# EasyEDA Pro project 第十届农装PCB工程.epro, schematic Schematic1_1
Board Name: F103作业板; Create Date: 2024-08-23; Page Name: P1; Project Name: 智能农装; Schematic Name: Schematic1_1; Update Date: 2024-09-09
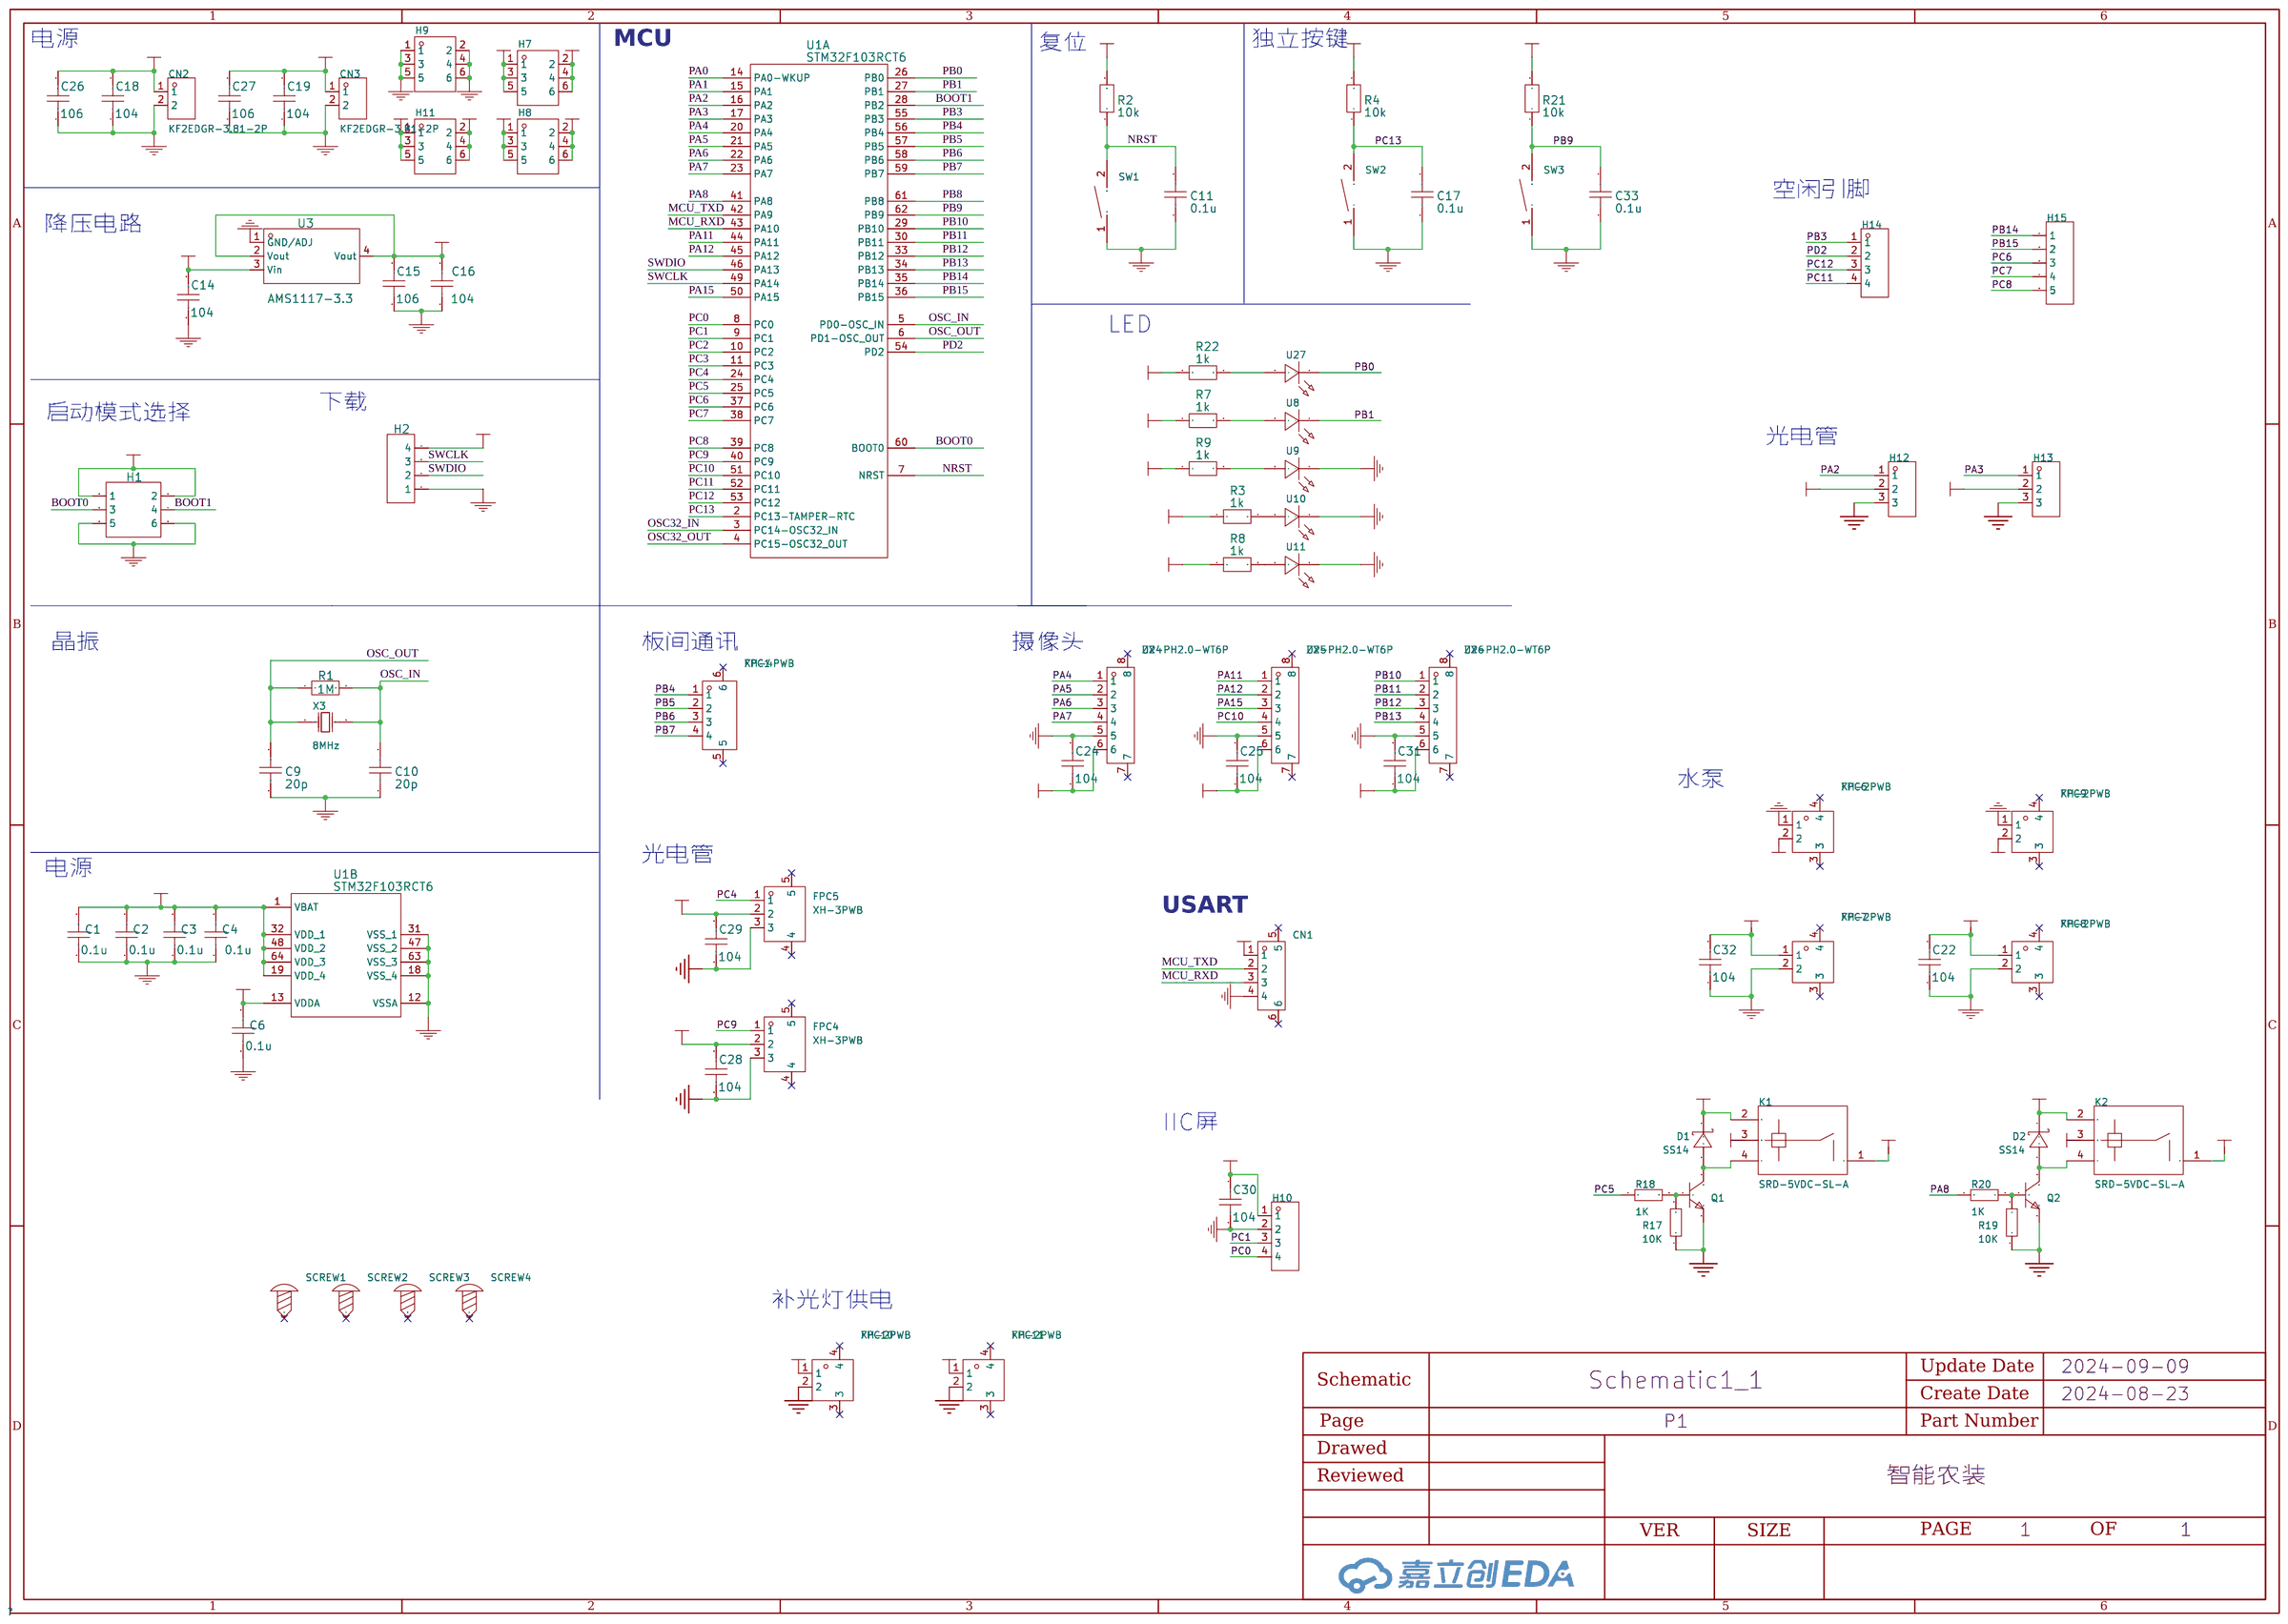
[diagram p1: schematic sheet]

## Parts
C1  0.1u  [C0805]
C2  0.1u  [C0805]
C3  0.1u  [C0805]
C4  0.1u  [C0805]
C6  0.1u  [C0805]
C9  20p  [C0805]
C10  20p  [C0805]
C11  0.1u  [C0805]
C14  104  [C0805]
C15  106  [C0805]
C16  104  [C0805]
C17  0.1u  [C0805]
C18  104  [C0805]
C19  104  [C0805]
C22  104  [C0805]
C24  104  [C0805]
C25  104  [C0805]
C26  106  [C0805]
C27  106  [C0805]
C28  104  [C0805]
C29  104  [C0805]
C30  104  [C0805]
C31  104  [C0805]
C32  104  [C0805]
C33  0.1u  [C0805]
CN1  -  [CONN-SMD_2.54-4P-WT-1]
CN2  KF2EDGR-3.81-2P  [CONN-TH_2P-P3.81_KF2EDGR-3.81-2P]
CN3  KF2EDGR-3.81-2P  [CONN-TH_2P-P3.81_KF2EDGR-3.81-2P]
D1  SS14  [SMA_L4.2-W2.6-LS5.3-RD]
D2  SS14  [SMA_L4.2-W2.6-LS5.3-RD]
FPC1  XH-4PWB  [CONN-SMD_4P-P2.50_DEALON_XH-4PWB]
FPC4  XH-3PWB  [CONN-SMD_3P-P2.50_DEALON_XH-3PWB]
FPC5  XH-3PWB  [CONN-SMD_3P-P2.50_DEALON_XH-3PWB]
FPC6  XH-2PWB  [CONN-SMD_2P-P2.50_DEALON_XH-2PWB_C2905024]
FPC7  XH-2PWB  [CONN-SMD_2P-P2.50_DEALON_XH-2PWB_C2905024]
FPC8  XH-2PWB  [CONN-SMD_2P-P2.50_DEALON_XH-2PWB_C2905024]
FPC9  XH-2PWB  [CONN-SMD_2P-P2.50_DEALON_XH-2PWB_C2905024]
FPC10  XH-2PWB  [CONN-SMD_2P-P2.50_DEALON_XH-2PWB_C2905024]
FPC11  XH-2PWB  [CONN-SMD_2P-P2.50_DEALON_XH-2PWB_C2905024]
H1  HDR-F-2.54_2x3  [HDR-F-2.54_2X3]
H2  2.54-1*4P母  [HDR-TH_4P-P2.54-V-F]
H7  -  [HDR-TH_6P-P2.54-V-R2-C3-S2.54_A2541WV-2X3P]
H8  -  [HDR-TH_6P-P2.54-V-R2-C3-S2.54_A2541WV-2X3P]
H9  -  [HDR-TH_6P-P2.54-V-R2-C3-S2.54_A2541WV-2X3P]
H10  -  [HDR-TH_4P-P2.54-V-M]
H11  -  [HDR-TH_6P-P2.54-V-R2-C3-S2.54_A2541WV-2X3P]
H12  -  [HDR-TH_3P-P2.54-V-F]
H13  -  [HDR-TH_3P-P2.54-V-F]
H14  -  [HDR-TH_4P-P2.54-V-F]
H15  -  [HDR-TH_5P-P2.54-V-F]
K1  SRD-5VDC-SL-A  [RELAY-TH_SRD-XXVDC-XX-A]
K2  SRD-5VDC-SL-A  [RELAY-TH_SRD-XXVDC-XX-A]
Q1  -  [S8050_SOT-23]
Q2  -  [S8050_SOT-23]
R1  1M  [R0805_NEW]
R2  10k  [R0805_NEW]
R3  1k  [R0805_NEW]
R4  10k  [R0805_NEW]
R7  1k  [R0805_NEW]
R8  1k  [R0805_NEW]
R9  1k  [R0805_NEW]
R17  10K  [R0805]
R18  1K  [R0805]
R19  10K  [R0805]
R20  1K  [R0805]
R21  10k  [R0805_NEW]
R22  1k  [R0805_NEW]
SCREW1  -  [M3螺丝]
SCREW2  -  [M3螺丝]
SCREW3  -  [M3螺丝]
SCREW4  -  [M3螺丝]
SW1  -  [SW-SMD_L6.1-W3.6-LS8.0]
SW2  -  [SW-SMD_L6.1-W3.6-LS8.0]
SW3  -  [SW-SMD_L6.1-W3.6-LS8.0]
U1  STM32F103RCT6  [STM32F103RCT6]  (sections 1,2)
U3  AMS1117-3.3  [AMS1117]
U8  -  [LED0805-RD_PURPLE]
U9  -  [LED0805-RD_PURPLE]
U10  -  [LED0805-RD_PURPLE]
U11  -  [LED0805-RD_PURPLE]
U24  ZX-PH2.0-WT6P  [CONN-SMD_6P-P2.00_ZX-PH2.0-WT6P]
U25  ZX-PH2.0-WT6P  [CONN-SMD_6P-P2.00_ZX-PH2.0-WT6P]
U26  ZX-PH2.0-WT6P  [CONN-SMD_6P-P2.00_ZX-PH2.0-WT6P]
U27  -  [LED0805-RD_PURPLE]
X3  8MHz  [OSC-SMD_L5.0-W3.2]

## Library data of the parts
C1-C4 C6 C11 C17 C33 = 0.1u
C9 C10 = 20p
C14 C16 C18 C19 C22 C24 C25 C28-C32 = 4.7u
C15 C26 C27 = 1u
CN1 = 2.54-4P-WT: 参考系列:XH;间距:2.5mm;插针结构:1x4P;排数:1;每排PIN数:4;行距:-;公母:公型插针;安装方式:卧贴;额定电流:500mA;工作温度范围:-25~+85;; Supplier Part: C722701; Manufacturer: CAX(创都); Supplier Footprint: SMD,P=2.5mm; JLCPCB Part Class: ExtendedPart; Datasheet: https://atta.szlcsc.com/upload/public/pdf/source/20200831/C722696_77A3476FAF7CFEE79ECA533977340414.pdf; Supplier: LCSC; Reference Series: XH; Pitch: 2.5mm; Pins Structure: 1x4P; Number of Rows: 1; Number of PINs Per Row: 4; Gender: 公型插针; Mounting Style: 卧贴; Current Rating (Max): 500mA; Operating Temperature Range: -25~+85
CN2 CN3 = KF2EDGR-3.81-2P: 连接器类型:板端/插座-闭口;结构:1x2P;间距:3.81mm;颜色:绿色;安装方式:弯针;排数:1;每排PIN数:2;额定电流:8A;额定电压:300V;工作温度范围:-40℃~+105℃;; LCSC Part Name: 3.81mm 1x2P 排数:1 每排P数:2; Supplier Part: C441182; Manufacturer: KEFA(科发); Supplier Footprint: 弯插,P=3.81mm; JLCPCB Part Class: Extended Part; Datasheet: https://atta.szlcsc.com/upload/public/pdf/source/20230331/6258E6C6BF04EFF922F3E5A9E72A4547.pdf; Supplier: LCSC; Connector Type: 板端/插座-闭口; Structure: 1x2P; Pitch: 3.81mm; Color: 绿色; Mounting Style: 弯针; Number of Pins: 2P; Number of Rows: 1; Number of PINs Per Row: 2; Current Rating (Max): 8A; Voltage Rating (Max): 300V; Operating Temperature Range: -40℃~+105℃
D1 D2 = SS14_C2480: 二极管配置:独立式;正向压降(Vf):550mV@1A;直流反向耐压(Vr):40V;平均整流电流(Io):1A;; LCSC Part Name: 电压:40V 电流:1A; Supplier Part: C2480; Manufacturer: MDD; Supplier Footprint: SMA(DO-214AC); JLCPCB Part Class: Basic Part; Datasheet: https://atta.szlcsc.com/upload/public/pdf/source/20230712/2DB6064CFBB99DE6DB116BEE8208BE66.pdf; Supplier: LCSC; Diode Configuration: 独立式; Forward Voltage (Vf@If): 550mV@1A; Reverse Voltage (Vr): 40V; Average Rectified Current (Io): 1A; Reverse Leakage Current (Ir): 500uA@40V
FPC1 = XH-4PWB: 插针结构:1x4P;间距:2.5mm;安装方式:卧贴;参考系列:XH;总PIN数:4P;排数:1;每排PIN数:4;行距:-;额定电流:3A;工作温度范围:-25℃~+85℃;; LCSC Part Name: 1x4P 间距:2.5mm 卧贴 系列:XH; Supplier Part: C2905026; Manufacturer: DEALON(德艺隆); Supplier Footprint: SMD,P=2.5mm,卧贴; JLCPCB Part Class: Extended Part; Datasheet: https://atta.szlcsc.com/upload/public/pdf/source/20211025/6C2B75DB1AEBD099C7E95723735B67A6.pdf; Supplier: LCSC; Pins Structure: 1x4P; Pitch: 2.5mm; Mounting Style: 卧贴; Reference Series: XH; Number of Pins: 4P; Number of Rows: 1; Number of PINs Per Row: 4; Current Rating (Max): 3A; Operating Temperature Range: -25℃~+85℃
FPC4 FPC5 = XH-3PWB: 插针结构:1x3P;间距:2.5mm;安装方式:卧贴;参考系列:XH;总PIN数:3P;排数:1;每排PIN数:3;行距:-;额定电流:3A;工作温度范围:-25℃~+85℃;; LCSC Part Name: 1x3P 间距:2.5mm 卧贴 系列:XH; Supplier Part: C2905025; Manufacturer: DEALON(德艺隆); Supplier Footprint: SMD,P=2.5mm,卧贴; JLCPCB Part Class: Extended Part; Datasheet: https://atta.szlcsc.com/upload/public/pdf/source/20211025/6C2B75DB1AEBD099C7E95723735B67A6.pdf; Supplier: LCSC; Pins Structure: 1x3P; Pitch: 2.5mm; Mounting Style: 卧贴; Reference Series: XH; Number of Pins: 3P; Number of Rows: 1; Number of PINs Per Row: 3; Current Rating (Max): 3A; Operating Temperature Range: -25℃~+85℃
FPC6-FPC11 = XH-2PWB: 插针结构:1x2P;间距:2.5mm;安装方式:卧贴;参考系列:XH;总PIN数:2P;排数:1;每排PIN数:2;行距:-;额定电流:3A;工作温度范围:-25℃~+85℃;; LCSC Part Name: 1x2P 间距:2.5mm 卧贴 系列:XH; Supplier Part: C2905024; Manufacturer: DEALON(德艺隆); Supplier Footprint: SMD,P=2.5mm,卧贴; JLCPCB Part Class: Extended Part; Datasheet: https://atta.szlcsc.com/upload/public/pdf/source/20211025/6C2B75DB1AEBD099C7E95723735B67A6.pdf; Supplier: LCSC; Pins Structure: 1x2P; Pitch: 2.5mm; Mounting Style: 卧贴; Reference Series: XH; Number of Pins: 2P; Number of Rows: 1; Number of PINs Per Row: 2; Current Rating (Max): 3A; Operating Temperature Range: -25℃~+85℃
H1 = HDR-F-2.54_2x3: Supplier Part: C65114; Supplier: LCSC
H2 = 2.54-1*4P母: 间距:2.54mm;总孔位数:4;排数:1;插孔结构:1x4P;行距:-;安装类型:直插;圆孔/方孔:方孔;额定电流:3A;额定电压:-;插孔方向:顶部;塑高:-;触头材质:青铜;触头镀层:-;工作温度范围:-40℃~+105℃;焊接温度(最大值):-;; LCSC Part Name: 2.54mm 1x4P; Supplier Part: C2718488; Manufacturer: BOOMELE(博穆精密); Supplier Footprint: 直插,P=2.54mm; JLCPCB Part Class: Extended Part; Datasheet: https://atta.szlcsc.com/upload/public/pdf/source/20210301/C2718488_F4427B881E42CAA8DDB0B1C12B3A522C.pdf; Supplier: LCSC; Pitch: 2.54mm; Number of Holes: 4; Number of Rows: 1; Holes Structure: 1x4P; Mounting Type: 直插; Circular Hole / Square Hole: 方孔; Current Rating (Max): 3A; Holes Direction: 顶部; Contact Material: 青铜; Operating Temperature Range: -40℃~+105℃
H7-H9 H11 = 210-72-03GB01: 间距:2.54mm;总PIN位数:6;排数:2;插针结构:2x3P;行距:2.54mm;安装类型:直插;圆针/方针:方针;额定电流:-;额定电压:-;配合针长度:6.1mm;塑高:2.5mm;端接针长度:3mm;触头材质:黄铜;触头镀层:-;工作温度范围:-40~+105;颜色:黑色;; LCSC Part Name: 2.54mm2x3P直插方针; Supplier Part: C402781; Manufacturer: PINREX(频锐科技); Supplier Footprint: 直插,P=2.54mm; JLCPCB Part Class: ExtendedPart; Datasheet: https://atta.szlcsc.com/upload/public/pdf/source/20190710/C402781_43A1999CD2F74066250BE88CD0917A4C.pdf; Supplier: LCSC; Pitch: 2.54mm; Number of Pins: 6; Number of Rows: 2; Pin Structure: 2x3P; Row Spacing: 2.54mm; Mounting Type: 直插; Circluar Pins/Square Pins: 方针; Length of Mating Pin: 6.1mm; Insulation Height: 2.5mm; Length of End Connection Pin: 3mm; Contact Material: 黄铜; Operating Temperature Range: -40~+105; Color: 黑色
H10 = HDR-M_2.54_1x4P: Supplier Part: C492403; Supplier Footprint: 插件
H12 H13 = HDR-F_2.54_1x3P: Supplier Part: C541850; Supplier Footprint: 插件
H14 = HDR-F_2.54_1x4P: Supplier Part: C2718488; Supplier Footprint: 插件
H15 = HDR-F_2.54_1x5P: Supplier Part: C50950; Supplier Footprint: 插件
K1 K2 = SRD-5VDC-SL-A: 线圈电压:5V;触点形式:一组常开:1A(单刀单掷-常开);触点容量(电阻负载):-;最大切换电压:250V@AC;最大切换电流:15A;; LCSC Part Name: 蓝色; Supplier Part: C140615; Manufacturer: 松乐; Supplier Footprint: 插件,15.6x19.2mm; JLCPCB Part Class: 扩展库; Datasheet: https://atta.szlcsc.com/upload/public/pdf/source/20200305/C490149_C96E4098A3B1FFB377D5AD2E40B7C2A8.pdf; Supplier: LCSC; Coil Voltage: 5V; Contact Form: 一组常开:1A(单刀单掷-常开); Pin Number: 4; Maximum Switching Voltage: 250V@AC; Coil Rated Power: 360mW; Maximum Switching Current: 15A; Coil Type: 无极性-单线圈; Coil Resistance: 70Ω; Contact Resistance: 100mΩ; Operate Time: 10ms; Release Time: 10ms
Q1 Q2 = S8050_SOT_NPN: Supplier Footprint: SOT-23
R1 = 1M
R2 R4 R21 = 10k
R3 R7-R9 R22 = 1k
R17-R20 = Res_0805: Supplier Footprint: 0805
SCREW1-SCREW4 = M3螺丝: Supplier Footprint: 插件
SW1-SW3 = TSA363G25-250B: 触点电流:50mA;额定电压(DC):12V;绝缘电阻:100MΩ;电路结构:单刀单掷;安装方式:立贴;按钮形状:矩形按钮;按钮/盖帽颜色:白色;带灯:无;作用力:250gf@±50gf;机械寿命:50000;工作温度:-25~+70;引脚样式:鸥翼型;开关长度:6.05mm;开关宽度:3.6mm;开关高度:2.5mm;带支架:否;; LCSC Part Name: 3*6*2.5白柄贴片250gf; Supplier Part: C354943; Manufacturer: BRIGHT(博瑞泰); Supplier Footprint: SMD; JLCPCB Part Class: ExtendedPart; Datasheet: https://atta.szlcsc.com/upload/public/pdf/source/20190426/C354943_F8D02988919B0D3B4D493E3C3D798834.pdf; Supplier: LCSC; Contact Current: 50mA; Voltage Rating (DC): 12V; Insulation Resistance: 100MΩ; Circuit: 单刀单掷; Mounting Style: 立贴; Actuator Style: 矩形按钮; Actuator/Cap Color: 白色; With Lamp: 无; Operating Force: 250gf@±50gf; Mechanical Life: 50000; Operating Temperature: -25~+70; Pin Style: 鸥翼型; Switch Length: 6.05mm; Switch Width: 3.6mm; Switch Height: 2.5mm; Strike Gundam: 否
U1 = STM32F103RCT6: Supplier: LCSC; Manufacturer: STMicroelectronics; image: //image.lceda.cn/szlcsc/C8323.jpg; Supplier Part: C8323; JLCPCB Part Class: Basic
U3 = AMS1117-3.3: Supplier: LCSC; Manufacturer: AMS; Supplier Part: C6186; JLCPCB Part Class: BasicPart
U8-U11 U27 = P2-0805UVTCS2-0.8T: 峰值波长:410nm~420nm;发光角度:120°;正向电压:3V;正向电流:30mA;功耗:90mW;工作温度:-40~+85;抗静电能力:2kV;辐射功率:-;; LCSC Part Name: 0805紫光0.8T; Supplier Part: C2827270; Manufacturer: TUOZHAN(拓展光电); Supplier Footprint: 0805; JLCPCB Part Class: ExtendedPart; Datasheet: https://atta.szlcsc.com/upload/public/pdf/source/20210423/C2827270_475A43B7F06EF651B4600F80B81B4A43.pdf; Supplier: LCSC; Peak Wavelength: 410nm~420nm; Viewing Angle: 120°; Forward Voltage: 3V; Forward Current: 30mA; Power Dissipation: 90mW; Operating Temperature: -40~+85; Antistatic Ability: 2kV
U24-U26 = ZX-PH2.0-WT6P: 插针结构:1x6P;间距:2mm;安装方式:卧贴;参考系列:PH;总PIN数:6P;排数:1;每排PIN数:6;行距:-;额定电流:2A;触头材质:黄铜;触头镀层:锡;工作温度范围:-25℃~+85℃;; Supplier Part: C7429693; Manufacturer: Megastar(兆星); Supplier Footprint: SMD,P=2mm,卧贴; JLCPCB Part Class: 扩展库; Datasheet: https://atta.szlcsc.com/upload/public/pdf/source/20230619/91235C4686D19130EBBA01431FCA1390.pdf; Supplier: LCSC; Pins Structure: 1x6P; Pitch: 2mm; Mounting Style: 卧贴; Reference Series: PH; Number of Pins: 6P; Number of Rows: 1; Number of PINs Per Row: 6; Current Rating (Max): 2A; Contact Material: 黄铜; Contact Plating: 锡; Operating Temperature Range: -25℃~+85℃
X3 = 7A08000006: 晶振类型:贴片无源晶振;频率:8MHz;频率公差:±20ppm;负载电容:12pF;等效串联电阻(ESR):80Ω;工作温度:-10~+70;; LCSC Part Name: 8MHz±20ppm12pF; Supplier Part: C128364; Manufacturer: TXC(晶技); Supplier Footprint: SMD5032-2P; JLCPCB Part Class: ExtendedPart; Datasheet: https://atta.szlcsc.com/upload/public/pdf/source/20170914/C128364_1505359754186967908.pdf; Supplier: LCSC; Crystal Type: 贴片无源晶振; Frequency Tolerance: ±20ppm; Load Capacitance: 12pF; Equivalent Series Resistance (ESR): 80Ω; Operating Temperature: -10~+70

## Nets
3.3V: C1.2 C2.2 C3.2 C4.2 C6.2 C15.2 C16.2 C30.2 H1.1 H1.2 H2.4 H8.1 H8.2 H8.3 H8.4 H8.5 H8.6 H10.1 R2.2 R4.2 R7.1 R9.1 R21.2 R22.1 U1.1(VBAT) U1.13(VDDA) U1.19(VDD_4) U1.32(VDD_1) U1.48(VDD_2) U1.64(VDD_3) U3.2(Vout) U3.4(Vout)
12V: C18.2 C26.2 CN2.1 FPC11.1 H11.1 H11.2 H11.3 H11.4 H11.5 H11.6 K1.3 K2.3 R3.1
+5V: C14.2 C19.2 C24.1 C25.1 C27.2 C28.2 C29.2 C31.1 CN1.1 CN3.1 D1.1(K) D2.1(K) FPC4.2 FPC5.2 FPC10.1 H7.1 H7.2 H7.3 H7.4 H7.5 H7.6 H12.2 H13.2 K1.2 K2.2 R8.1 U3.3(Vin) U24.6 U25.6 U26.6
GND: C1.1 C2.1 C3.1 C4.1 C6.1 C9.1 C10.1 C11.1 C14.1 C15.1 C16.1 C17.1 C18.1 C19.1 C22.1 C24.2 C25.2 C26.1 C27.1 C28.1 C29.1 C30.1 C31.2 C32.1 C33.1 CN1.4 CN2.2 CN3.2 FPC4.3 FPC5.3 FPC6.1 FPC7.2 FPC8.2 FPC9.1 FPC10.2 FPC11.2 H1.5 H1.6 H2.1 H9.1 H9.2 H9.3 H9.4 H9.5 H9.6 H10.2 H12.3 H13.3 Q1.2 Q2.2 R17.1 R19.1 SW1.1 SW2.1 SW3.1 U1.12(VSSA) U1.18(VSS_4) U1.31(VSS_1) U1.47(VSS_2) U1.63(VSS_3) U3.1(GND/ADJ) U9.1(-) U10.1(-) U11.1(-) U24.5 U25.5 U26.5
BOOT0: H1.3 U1.60(BOOT0)
BOOT1: H1.4 U1.28(PB2)
MCU_RXD: CN1.3 U1.43(PA10)
MCU_TXD: CN1.2 U1.42(PA9)
NRST: C11.2 R2.1 SW1.2 U1.7(NRST)
OSC32_IN: U1.3(PC14-OSC32_IN)
OSC32_OUT: U1.4(PC15-OSC32_OUT)
OSC_IN: C10.2 R1.2 U1.5(PD0-OSC_IN) X3.2(OSC2)
OSC_OUT: C9.2 R1.1 U1.6(PD1-OSC_OUT) X3.1(OSC1)
PA0: U1.14(PA0-WKUP)
PA1: U1.15(PA1)
PA2: H12.1 U1.16(PA2)
PA3: H13.1 U1.17(PA3)
PA4: U1.20(PA4) U24.1
PA5: U1.21(PA5) U24.2
PA6: U1.22(PA6) U24.3
PA7: U1.23(PA7) U24.4
PA8: R20.1 U1.41(PA8)
PA11: U1.44(PA11) U25.1
PA12: U1.45(PA12) U25.2
PA15: U1.50(PA15) U25.3
PB0: U1.26(PB0) U27.1(-)
PB1: U1.27(PB1) U8.1(-)
PB3: H14.1 U1.55(PB3)
PB4: FPC1.1 U1.56(PB4)
PB5: FPC1.2 U1.57(PB5)
PB6: FPC1.3 U1.58(PB6)
PB7: FPC1.4 U1.59(PB7)
PB8: U1.61(PB8)
PB9: C33.2 R21.1 SW3.2 U1.62(PB9)
PB10: U1.29(PB10) U26.1
PB11: U1.30(PB11) U26.2
PB12: U1.33(PB12) U26.3
PB13: U1.34(PB13) U26.4
PB14: H15.1 U1.35(PB14)
PB15: H15.2 U1.36(PB15)
PC0: H10.4 U1.8(PC0)
PC1: H10.3 U1.9(PC1)
PC2: U1.10(PC2)
PC3: U1.11(PC3)
PC4: FPC5.1 U1.24(PC4)
PC5: R18.1 U1.25(PC5)
PC6: H15.3 U1.37(PC6)
PC7: H15.4 U1.38(PC7)
PC8: H15.5 U1.39(PC8)
PC9: FPC4.1 U1.40(PC9)
PC10: U1.51(PC10) U25.4
PC11: H14.4 U1.52(PC11)
PC12: H14.3 U1.53(PC12)
PC13: C17.2 R4.1 SW2.2 U1.2(PC13-TAMPER-RTC)
PD2: H14.2 U1.54(PD2)
SWCLK: H2.3 U1.49(PA14)
SWDIO: H2.2 U1.46(PA13)
V_PUMP_D: C22.2 FPC8.1 FPC9.2 K2.1
V_PUMP_S: C32.2 FPC6.2 FPC7.1 K1.1
$1N23071: R7.2 U8.2(+)
$1N23222: R9.2 U9.2(+)
$1N23931: R3.2 U10.2(+)
$1N24046: R8.2 U11.2(+)
$1N38531: Q1.1 R17.2 R18.2
$1N38532: D1.2(A) K1.4 Q1.3
$1N38756: Q2.1 R19.2 R20.2
$1N38760: D2.2(A) K2.4 Q2.3
$1N48101: R22.2 U27.2(+)

Not connected (* = marked no-connect by the designer): CN1 5* 6*; FPC1 5* 6*; FPC4 4* 5*; FPC5 4* 5*; FPC6 3* 4*; FPC7 3* 4*; FPC8 3* 4*; FPC9 3* 4*; FPC10 3* 4*; FPC11 3* 4*; SCREW1 1*; SCREW2 1*; SCREW3 1*; SCREW4 1*; U24 7* 8*; U25 7* 8*; U26 7* 8*

## Notes on the sheet
- 电源
- MCU
- 复位
- 独立按键
- 空闲引脚
- 降压电路
- LED
- 下载
- 启动模式选择
- 光电管
- 晶振
- 板间通讯
- 摄像头
- 水泵
- 光电管
- 电源
- USART
- IIC屏
- 补光灯供电
